# EAGLE schematic transciever_test_schematic (EAGLE 8.4.1)
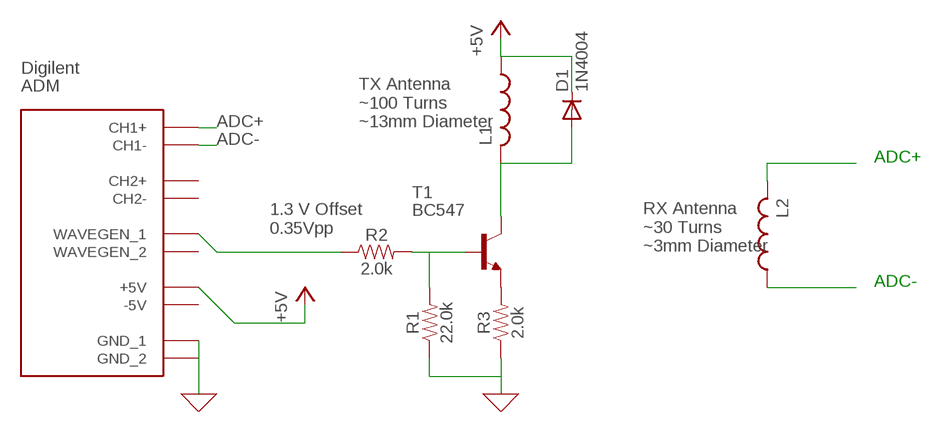
[diagram p0: schematic, sheet 1]

## Parts
D1  1N4004  [DO41-10]
L1  L-USIR-4  [IR-4]
L2  L-USIR-4  [IR-4]
R1  22.0k  2.0KOHM-0603-1/10W-5%  [0603]
R2  2.0k  2.0KOHM-0603-1/10W-5%  [0603]
R3  2.0k  2.0KOHM-0603-1/10W-5%  [0603]
T1  BC547  [TO92]
U$2  DIGILENT_ADM  [DIGILENT_ADM]

## Nets
0: R1.1 R3.1 U$2.GND_2(GND_1) ; supply symbol labelled GND
+5V: D1.C L1.1 U$2.+5V
ADC+: U$2.CH1+
ADC-: U$2.CH1-
N$1: R3.2 T1.1(E)
N$2: R1.2 R2.2 T1.2(B)
N$3: R2.1 U$2.WAVEGEN_1
N$4: D1.A L1.2 T1.3(C)
N$5: L2.2
N$6: L2.1
Unconnected: U$2.-5V U$2.CH2+ U$2.CH2- U$2.GND(GND_2) U$2.WAVEGEN_2

## Notes on the sheet
- TX Antenna
  ~100 Turns
  ~13mm Diameter
- ADC+
- 1.3 V Offset
  0.35Vpp
- RX Antenna
  ~30 Turns
  ~3mm Diameter
- ADC-

## Library data of the parts
D1 = diode:1N4004: DIODE general purpose rectifier, 1 A
L1 L2 = rcl:L-US: INDUCTOR, American symbol
R1 = SparkFun-Resistors:2.0KOHM: 2kΩ resistor A resistor is a passive two-terminal electrical component that implements electrical resistance as a circuit element. Resistors act to reduce current flow, and, at the same time, act to lower voltage levels within circuits. - Wikipedia; PROD_ID: RES-08296; VALUE: 2.0k
R2 R3 = SparkFun-Resistors:2.0KOHM: 2kΩ resistor A resistor is a passive two-terminal electrical component that implements electrical resistance as a circuit element. Resistors act to reduce current flow, and, at the same time, act to lower voltage levels within circuits. - Wikipedia; PROD_ID: RES-08296
T1 = transistor:BC547: NPN TRANSISTOR
U$2 = TTE:DIGILENT_ADM